# Altium schematic sheet SHTC3.SchDoc
size A4
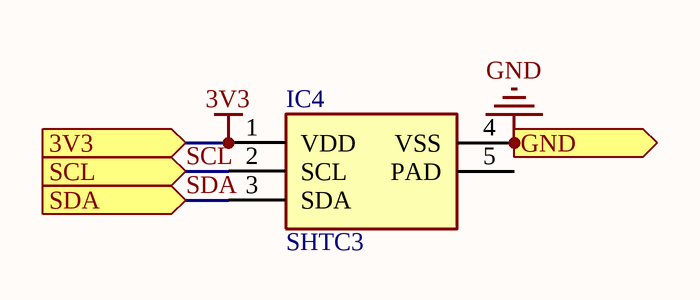
[diagram p0: SHTC3.SchDoc]

## Parts
IC4  SHTC3  [SHTC3]

## Ports
3V3 (in), GND (in), SCL (in), SDA (in)

## Nets
3V3: IC4.1(VDD) ; port 3V3
GND: IC4.4(VSS) ; port GND
SCL: IC4.2(SCL) ; port SCL
SDA: IC4.3(SDA) ; port SDA

Not connected (* = marked no-connect by the designer): IC4 5(PAD)

## Library data of the parts
IC4 = SHTC3: Integrated Circuit; Manufacturer_Name: Sensirion; Datasheet Link: https://www.glynshop.com/erp/owweb/Daten/Datenblaetter/Sensirion/SHTC3.pdf; Height: 0mm; Manufacturer_Part_Number: SHTC3; Mouser Part Number: 403-SHTC3; Mouser Price/Stock: https://www.mouser.com/Search/Refine.aspx?Keyword=403-SHTC3